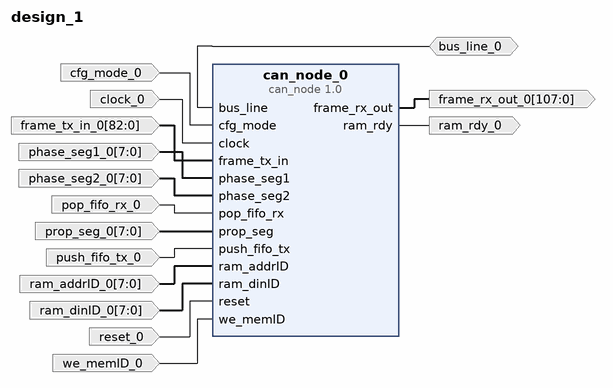
[diagram p0: block diagram of the top level]
# Vivado block design design_1, xc7a50tcpg236-1, Vivado 2025.1
create_bd_design design_1

create_bd_port -dir IO bus_line_0
create_bd_port -dir I cfg_mode_0
create_bd_port -dir I -type clk clock_0
create_bd_port -dir O -from 107 -to 0 frame_rx_out_0
create_bd_port -dir I -from 82 -to 0 frame_tx_in_0
create_bd_port -dir I -from 7 -to 0 phase_seg1_0
create_bd_port -dir I -from 7 -to 0 phase_seg2_0
create_bd_port -dir I pop_fifo_rx_0
create_bd_port -dir I -from 7 -to 0 prop_seg_0
create_bd_port -dir I push_fifo_tx_0
create_bd_port -dir I -from 7 -to 0 ram_addrID_0
create_bd_port -dir I -from 7 -to 0 ram_dinID_0
create_bd_port -dir O ram_rdy_0
create_bd_port -dir I -type rst reset_0
create_bd_port -dir I we_memID_0

create_bd_cell -type ip -vlnv xilinx.com:user:can_node:1.0 can_node_0

# ---- connections ----

connect_bd_net [get_bd_ports bus_line_0] [get_bd_pins can_node_0/bus_line]
connect_bd_net [get_bd_pins can_node_0/frame_rx_out] [get_bd_ports frame_rx_out_0]
connect_bd_net [get_bd_pins can_node_0/ram_rdy] [get_bd_ports ram_rdy_0]
connect_bd_net -net cfg_mode_0_1 [get_bd_ports cfg_mode_0] [get_bd_pins can_node_0/cfg_mode]
connect_bd_net -net clock_0_1 [get_bd_ports clock_0] [get_bd_pins can_node_0/clock]
connect_bd_net -net frame_tx_in_0_1 [get_bd_ports frame_tx_in_0] [get_bd_pins can_node_0/frame_tx_in]
connect_bd_net -net phase_seg1_0_1 [get_bd_ports phase_seg1_0] [get_bd_pins can_node_0/phase_seg1]
connect_bd_net -net phase_seg2_0_1 [get_bd_ports phase_seg2_0] [get_bd_pins can_node_0/phase_seg2]
connect_bd_net -net pop_fifo_rx_0_1 [get_bd_ports pop_fifo_rx_0] [get_bd_pins can_node_0/pop_fifo_rx]
connect_bd_net -net prop_seg_0_1 [get_bd_ports prop_seg_0] [get_bd_pins can_node_0/prop_seg]
connect_bd_net -net push_fifo_tx_0_1 [get_bd_ports push_fifo_tx_0] [get_bd_pins can_node_0/push_fifo_tx]
connect_bd_net -net ram_addrID_0_1 [get_bd_ports ram_addrID_0] [get_bd_pins can_node_0/ram_addrID]
connect_bd_net -net ram_dinID_0_1 [get_bd_ports ram_dinID_0] [get_bd_pins can_node_0/ram_dinID]
connect_bd_net -net reset_0_1 [get_bd_ports reset_0] [get_bd_pins can_node_0/reset]
connect_bd_net -net we_memID_0_1 [get_bd_ports we_memID_0] [get_bd_pins can_node_0/we_memID]

validate_bd_design
save_bd_design
